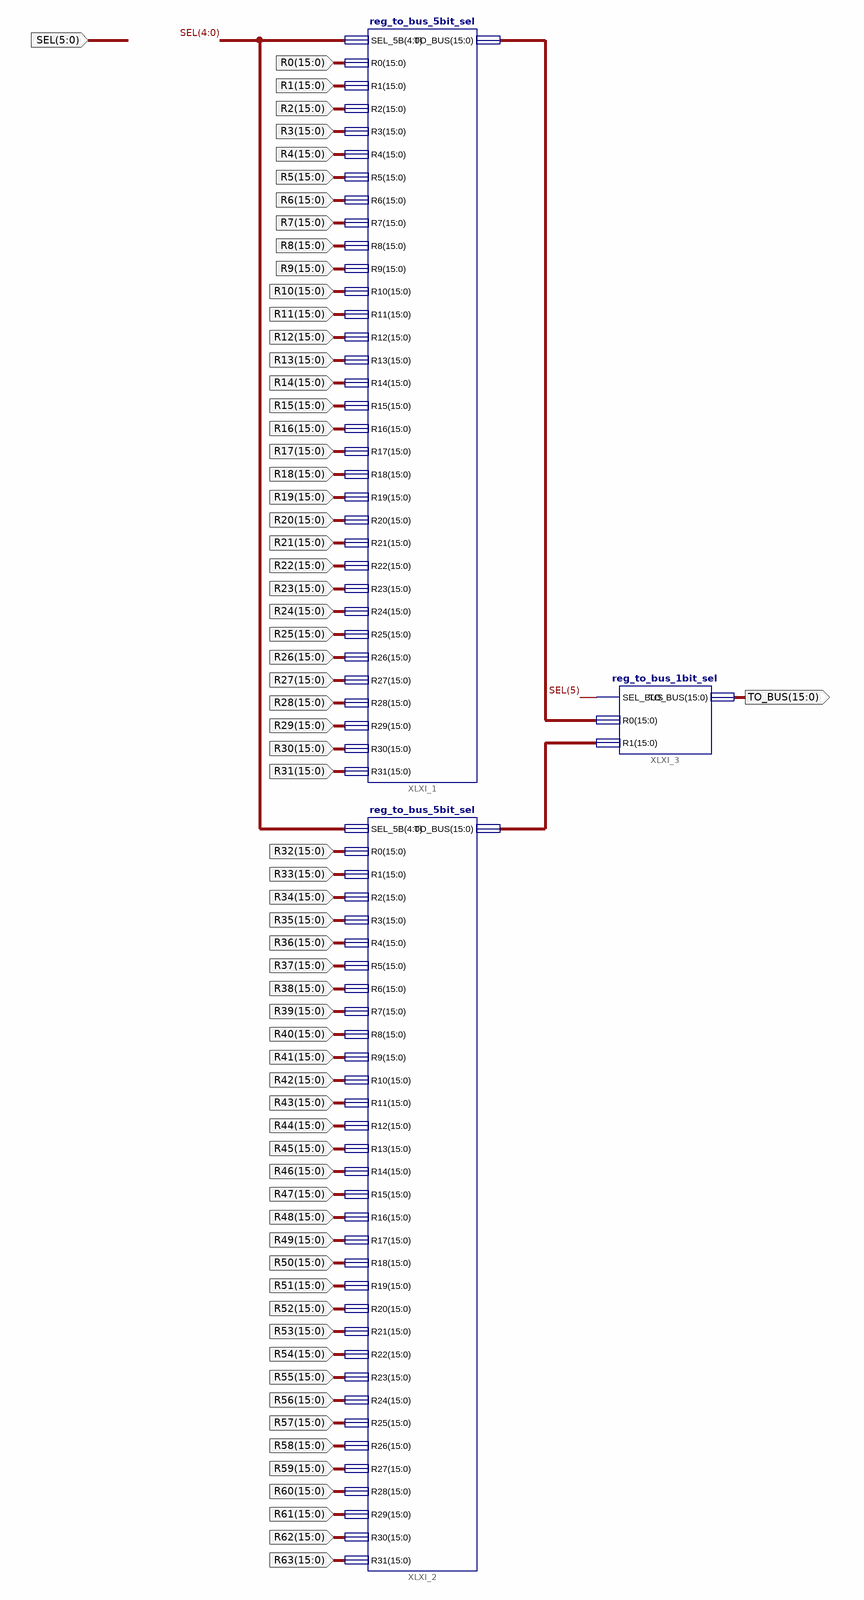
[diagram p0: schematic sheet 1]
// Xilinx ISE schematic reg_to_bus_6bit_sel.sch (artix7) as structural Verilog: 3 symbols, 66 ports
module reg_to_bus_6bit_sel (
  input  [5:0] SEL,
  input  [15:0] R0,
  input  [15:0] R1,
  input  [15:0] R2,
  input  [15:0] R3,
  input  [15:0] R4,
  input  [15:0] R5,
  input  [15:0] R6,
  input  [15:0] R7,
  input  [15:0] R8,
  input  [15:0] R9,
  input  [15:0] R10,
  input  [15:0] R11,
  input  [15:0] R12,
  input  [15:0] R13,
  input  [15:0] R14,
  input  [15:0] R15,
  input  [15:0] R16,
  input  [15:0] R17,
  input  [15:0] R18,
  input  [15:0] R19,
  input  [15:0] R20,
  input  [15:0] R21,
  input  [15:0] R22,
  input  [15:0] R23,
  input  [15:0] R24,
  input  [15:0] R25,
  input  [15:0] R26,
  input  [15:0] R27,
  input  [15:0] R28,
  input  [15:0] R29,
  input  [15:0] R30,
  input  [15:0] R31,
  input  [15:0] R32,
  input  [15:0] R33,
  input  [15:0] R34,
  input  [15:0] R35,
  input  [15:0] R36,
  input  [15:0] R37,
  input  [15:0] R38,
  input  [15:0] R39,
  input  [15:0] R40,
  input  [15:0] R41,
  input  [15:0] R42,
  input  [15:0] R43,
  input  [15:0] R44,
  input  [15:0] R45,
  input  [15:0] R46,
  input  [15:0] R47,
  input  [15:0] R48,
  input  [15:0] R49,
  input  [15:0] R50,
  input  [15:0] R51,
  input  [15:0] R52,
  input  [15:0] R53,
  input  [15:0] R54,
  input  [15:0] R55,
  input  [15:0] R56,
  input  [15:0] R57,
  input  [15:0] R58,
  input  [15:0] R59,
  input  [15:0] R60,
  input  [15:0] R61,
  input  [15:0] R62,
  input  [15:0] R63,
  output [15:0] TO_BUS
);

  wire [15:0] XLXN_1, XLXN_2;

  reg_to_bus_5bit_sel XLXI_1 (
    .SEL_5B(SEL[4:0]), .R0(R0), .R1(R1), .R2(R2), .R3(R3), .R4(R4), .R5(R5), .R6(R6), .R7(R7), .R8(R8),
    .R9(R9), .R10(R10), .R11(R11), .R12(R12), .R13(R13), .R14(R14), .R15(R15), .R16(R16), .R17(R17),
    .R18(R18), .R19(R19), .R20(R20), .R21(R21), .R22(R22), .R23(R23), .R24(R24), .R25(R25), .R26(R26),
    .R27(R27), .R28(R28), .R29(R29), .R30(R30), .R31(R31), .TO_BUS(XLXN_2));
  reg_to_bus_5bit_sel XLXI_2 (
    .SEL_5B(SEL[4:0]), .R0(R32), .R1(R33), .R2(R34), .R3(R35), .R4(R36), .R5(R37), .R6(R38), .R7(R39),
    .R8(R40), .R9(R41), .R10(R42), .R11(R43), .R12(R44), .R13(R45), .R14(R46), .R15(R47), .R16(R48),
    .R17(R49), .R18(R50), .R19(R51), .R20(R52), .R21(R53), .R22(R54), .R23(R55), .R24(R56), .R25(R57),
    .R26(R58), .R27(R59), .R28(R60), .R29(R61), .R30(R62), .R31(R63), .TO_BUS(XLXN_1));
  reg_to_bus_1bit_sel XLXI_3 (.SEL_BUS(SEL[5]), .R0(XLXN_2), .R1(XLXN_1), .TO_BUS(TO_BUS));
endmodule
